# Altium project robot_extension_board.PrjPcb
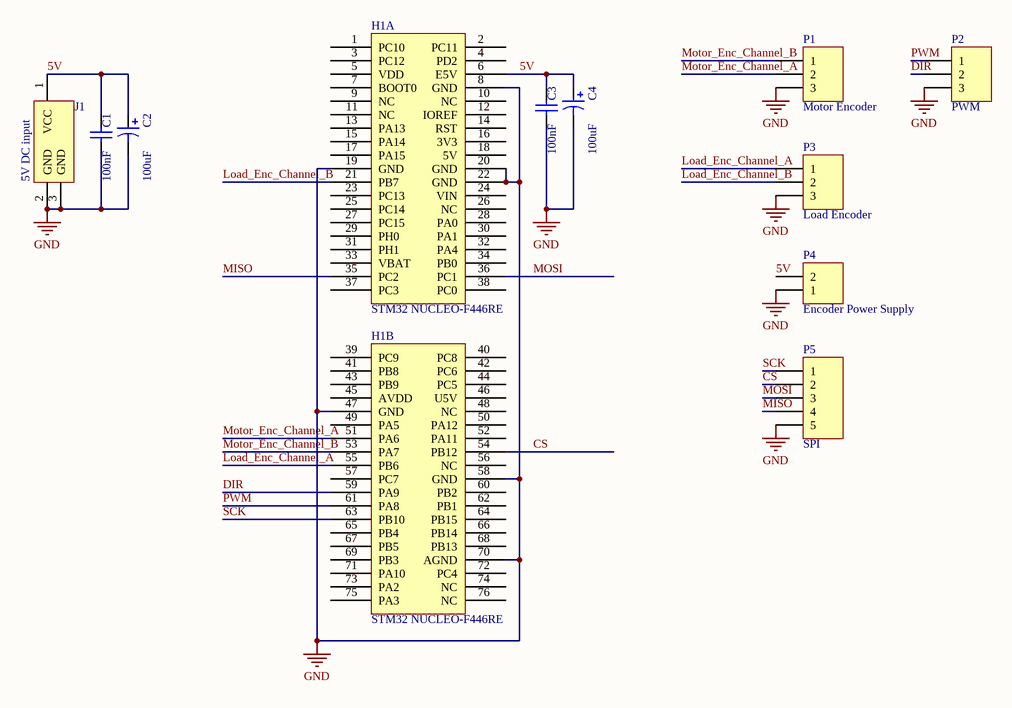
[diagram p0: robot_extension_board.SchDoc]
1 sheet, 11 parts. Net scope: global (net labels, ports and power ports of the same name join across sheets).
Board file: robot_extension_board.PcbDoc

## Sheet robot_extension_board.SchDoc
size A

### Parts
C1  value 100nF  [C_0603]  (hidden comment: Cap)
C2  value 100uF  [C_TANTANLUM_E]  (hidden comment: Cap Pol1)
C3  value 100nF  [C_0603]  (hidden comment: Cap)
C4  value 100uF  [C_TANTANLUM_E]  (hidden comment: Cap Pol1)
H1  STM32 NUCLEO-F446RE  [STM32 NUCLEO 64]  (parts A,B of 2)
J1  5V DC input  [Female_Barrel_Connector]
P1  Motor Encoder  [JST-3-Vertical-2.54mm]
P2  PWM  [JST-3-Vertical-2.54mm]
P3  Load Encoder  [JST-3-Vertical-2.54mm]
P4  Encoder Power Supply  [JST-2-Vertical-2.54mm]
P5  SPI  [JST-5-Vertical-2.54mm]

### Nets
GND: C1.1 C2.2 C3.1 C4.2 H1.8(GND) H1.19(GND) H1.20(GND) H1.22(GND) H1.47(GND) H1.58(GND) H1.70(AGND) J1.2(GND) J1.3(GND) P1.3 P2.3 P3.3 P4.1 P5.5
5V: C1.2 C2.1 C3.2 C4.1 H1.6(E5V) J1.1(VCC) P4.2
CS: H1.54(PB12) P5.2
DIR: H1.59(PA9) P2.2
Load_Enc_Channel_A: H1.55(PB6) P3.1
Load_Enc_Channel_B: H1.21(PB7) P3.2
MISO: H1.35(PC2) P5.4
MOSI: H1.36(PC1) P5.3
Motor_Enc_Channel_A: H1.51(PA6) P1.2
Motor_Enc_Channel_B: H1.53(PA7) P1.1
PWM: H1.61(PA8) P2.1
SCK: H1.63(PB10) P5.1

Not connected (* = marked no-connect by the designer): H1 1(PC10) 2(PC11) 3(PC12) 4(PD2) 5(VDD) 7(BOOT0) 9(NC) 10(NC) 11(NC) 12(IOREF) 13(PA13) 14(RST) 15(PA14) 16(3V3) 17(PA15) 18(5V) 23(PC13) 24(VIN) 25(PC14) 26(NC) 27(PC15) 28(PA0) 29(PH0) 30(PA1) 31(PH1) 32(PA4) 33(VBAT) 34(PB0) 37(PC3) 38(PC0) 39(PC9) 40(PC8) 41(PB8) 42(PC6) 43(PB9) 44(PC5) 45(AVDD) 46(U5V) 48(NC) 49(PA5) 50(PA12) 52(PA11) 56(NC) 57(PC7) 60(PB2) 62(PB1) 64(PB15) 65(PB4) 66(PB14) 67(PB5) 68(PB13) 69(PB3) 71(PA10) 72(PC4) 73(PA2) 74(NC) 75(PA3) 76(NC)

### Library data of the parts
C1 C3 = Cap: Capacitor; Published: 8-Jun-2000; LatestRevisionDate: 17-Jul-2002; LatestRevisionNote: Re-released for DXP Platform.; PackageReference: RAD-0.3; Publisher: Altium Limited; PackageDescription: Radial Cap, Thru-Hole; 2 Leads; 0.3 in Pin Spacing
C2 C4 = Cap Pol1: Polarized Capacitor (Radial); Published: 8-Jun-2000; LatestRevisionDate: 17-Jul-2002; LatestRevisionNote: Re-released for DXP Platform.; PackageReference: RB7.6-15; Publisher: Altium Limited; PackageDescription: Polarized Capacitor (Radial); 2 Leads
J1 = Female_Barrel_Connector
P1-P3 = Header 3: Header, 3-Pin; LatestRevisionDate: 17-Jul-2002; LatestRevisionNote: Re-released for DXP Platform.; Publisher: Altium Limited
P4 = Header 2: Header, 2-Pin; LatestRevisionDate: 17-Jul-2002; LatestRevisionNote: Re-released for DXP Platform.; Publisher: Altium Limited
P5 = Header 5: Header, 5-Pin; LatestRevisionDate: 17-Jul-2002; LatestRevisionNote: Re-released for DXP Platform.; Publisher: Altium Limited